# EAGLE design compressor contro0l (EAGLE 9.6.2)
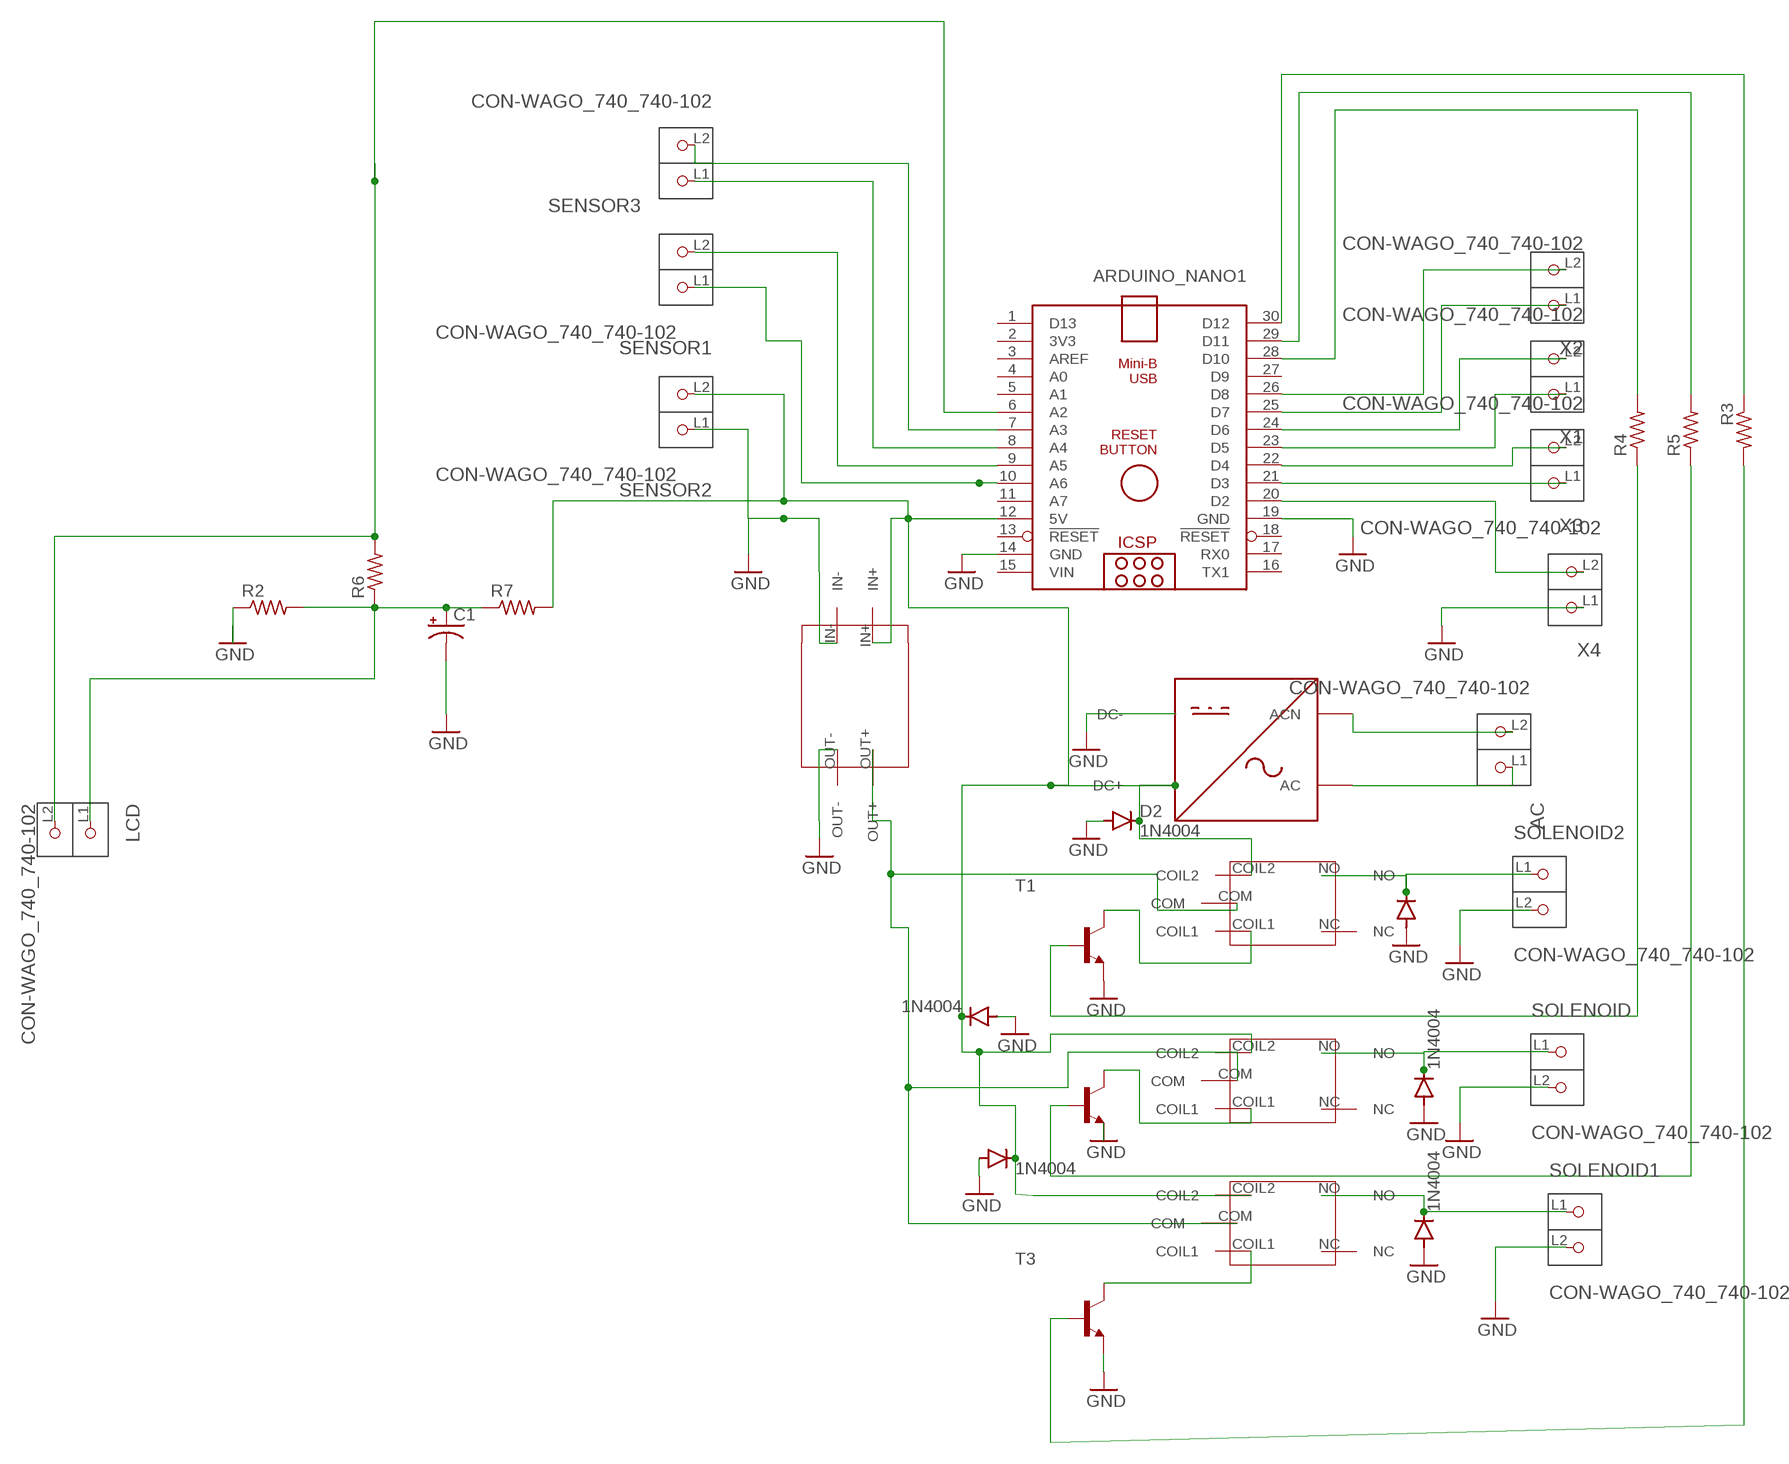
[diagram p0: schematic, sheet 1]

## Parts
AC  CON-WAGO_740_740-102  [CON-WAGO_740_P-740-102]
ACDC  RPD10W1S  [2343]
ARDUINO_NANO1  ARDUINONANOV30-GHIT_ARDUINO_NANO  [ARDUINONANOV30-GHIT_ARDUINO_NANO]
C1  CPOL-USE3.5-8  [E3,5-8]
D2  1N4004  [DO41-10]
D3  1N4004  [DO41-10]
D4  1N4004  [DO41-10]
D5  1N4004  [DO41-10]
D6  1N4004  [DO41-10]
D7  1N4004  [DO41-10]
LCD  CON-WAGO_740_740-102  [CON-WAGO_740_P-740-102]
R2  R-US_0207/10  [0207/10]
R3  R-US_0613/15  [P0613/15]
R4  R-US_0613/15  [P0613/15]
R5  R-US_0613/15  [P0613/15]
R6  R-US_0207/10  [0207/10]
R7  R-US_0207/10  [0207/10]
SENSOR1  CON-WAGO_740_740-102  [CON-WAGO_740_P-740-102]
SENSOR2  CON-WAGO_740_740-102  [CON-WAGO_740_P-740-102]
SENSOR3  CON-WAGO_740_740-102  [CON-WAGO_740_P-740-102]
SOLENOID  CON-WAGO_740_740-102  [CON-WAGO_740_P-740-102]
SOLENOID1  CON-WAGO_740_740-102  [CON-WAGO_740_P-740-102]
SOLENOID2  CON-WAGO_740_740-102  [CON-WAGO_740_P-740-102]
T1  2N2222-NPN-TO92-EBC  [TO92-EBC]
T2  2N2222-NPN-TO92-EBC  [TO92-EBC]
T3  2N2222-NPN-TO92-EBC  [TO92-EBC]
U$2  DC-DCBUCK  [DC-DCBUCK]
U$3  MRELAY2MRELAY2  [MRELAY]
U$4  MRELAY2MRELAY2  [MRELAY]
U$5  MRELAY2MRELAY2  [MRELAY]
X1  CON-WAGO_740_740-102  [CON-WAGO_740_P-740-102]
X2  CON-WAGO_740_740-102  [CON-WAGO_740_P-740-102]
X3  CON-WAGO_740_740-102  [CON-WAGO_740_P-740-102]
X4  CON-WAGO_740_740-102  [CON-WAGO_740_P-740-102]

## Nets
GND: ACDC.DC- ARDUINO_NANO1.14(GND) ARDUINO_NANO1.19(GND) C1.- D2.A D3.A D4.A D5.A D6.A D7.A R2.1 SENSOR2.L1(P1) SOLENOID1.L2(P2) SOLENOID2.L2(P2) SOLENOID.L2(P2) T1.E T2.E T3.E U$2.IN- U$2.OUT- X4.L1(P1)
N$1: ARDUINO_NANO1.9(A5) SENSOR1.L2(P2)
N$2: ARDUINO_NANO1.20(D2) X4.L2(P2)
N$3: ARDUINO_NANO1.21(D3) X3.L1(P1)
N$4: ARDUINO_NANO1.22(D4) X3.L2(P2)
N$5: ARDUINO_NANO1.23(D5) X1.L1(P1)
N$6: ARDUINO_NANO1.24(D6) X1.L2(P2)
N$7: ARDUINO_NANO1.30(D12) R3.1
N$8: ARDUINO_NANO1.25(D7) X2.L1(P1)
N$9: ACDC.DC+ ARDUINO_NANO1.12(5V) D2.C D4.C D5.C R7.2 SENSOR2.L2(P2) U$2.IN+ U$3.COIL2 U$4.COIL2 U$5.COIL2
N$10: ARDUINO_NANO1.10(A6) SENSOR1.L1(P1)
N$11: AC.L2(P2) ACDC.ACN
N$12: ARDUINO_NANO1.8(A4) SENSOR3.L1(P1)
N$13: AC.L1(P1) ACDC.AC
N$14: ARDUINO_NANO1.28(D10) R4.2
N$15: R4.1 T1.B
N$16: ARDUINO_NANO1.29(D11) R5.2
N$17: ARDUINO_NANO1.26(D8) X2.L2(P2)
N$18: U$2.OUT+ U$3.COM U$4.COM U$5.COM
N$19: ARDUINO_NANO1.7(A3) SENSOR3.L2(P2)
N$20: R3.2 T3.B
N$21: R5.1 T2.B
N$22: T2.C U$3.COIL1
N$23: T1.C U$4.COIL1
N$24: T3.C U$5.COIL1
N$26: D7.C SOLENOID1.L1(P1) U$5.NO
N$27: D6.C SOLENOID2.L1(P1) U$4.NO
N$29: D3.C SOLENOID.L1(P1) U$3.NO
N$32: ARDUINO_NANO1.6(A2) LCD.L2(P2) R6.2
N$33: C1.+ LCD.L1(P1) R2.2 R6.1 R7.1
Unconnected: ARDUINO_NANO1.1(D13) ARDUINO_NANO1.2(3V3) ARDUINO_NANO1.3(AREF) ARDUINO_NANO1.4(A0) ARDUINO_NANO1.5(A1) ARDUINO_NANO1.11(A7) ARDUINO_NANO1.13(!RESET) ARDUINO_NANO1.16(TX1) ARDUINO_NANO1.17(RX0) ARDUINO_NANO1.18(!RESET) ARDUINO_NANO1.27(D9) U$3.NC U$4.NC U$5.NC

## Power pins joined to a net without a drawn wire
VIN: ARDUINO_NANO1.15(VIN)

## Library data of the parts
AC LCD SENSOR1-SENSOR3 SOLENOID SOLENOID1 SOLENOID2 X1-X4 = Termnal block:CON-WAGO_740_740-102: Serie 740, Klemmenleiste für Leiterplatten 1 Lötstift/Pol / Series 740, PCB terminal strip 1 solder pin/pole Polzahl / Pole No.: 2 Rastermaß / Pitch: 5 mm Bemessungsspannung / Rated Voltage: 320 V Nennstrom / Nominal Current: 16 A Leiterquerschnitt / Conductor Size: 0.08 - 2.5 mm² Anschlusstechnik / Connection Technology: CAGE CLAMP® Lötstiftlänge: / Solder Pin Length: 5.1 mm Leitereinführung (zur Platine) / Conductor entry angle (to PCB): 0 ° Farbe / Color: grau / gray Stand: 01.01.2012. Die jeweils aktuellen Daten zu diesem Artikel finden Sie in unserem Produktkatalog, den Sie unter www.wago.com einsehen können. As of: 01/01/2012. Please find the newest data for this article in our product catalogue, which can be viewed under www.wago.com.
ACDC = My_libray:RPD10W1S
ARDUINO_NANO1 = Arduino Nano GHII:ARDUINONANOV30-GHIT_ARDUINO_NANO: Arduino Nano V3.0 Overview: The Arduino Nano is a small, complete, and breadboard-friendly board based on the ATmega328 (Arduino Nano 3.x) or ATmega168 (Arduino Nano 2.x). It has more or less the same functionality of the Arduino Duemilanove, but in a different package. It lacks only a DC power jack, and works with a Mini-B USB cable instead of a standard one. The Nano was designed and is being produced by Gravitech. Specifications: Microcontroller Atmel ATmega168 or ATmega328 Operating Voltage (logic level) 5 V Input Voltage (recommended) 7-12 V Input Voltage (limits) 6-20 V Digital I/O Pins 14 (of which 6 provide PWM output) Analog Input Pins 8 DC Current per I/O Pin 40 mA Flash Memory 16 KB (ATmega168) or 32 KB (ATmega328) of which 2 KB used by bootloader SRAM 1 KB (ATmega168) or 2 KB (ATmega328) EEPROM 512 bytes (ATmega168) or 1 KB (ATmega328) Clock Speed 16 MHz Dimensions 0.73" x 1.70" Length 45 mm Width 18 mm Weigth 5 g Power: The Arduino Nano can be powered via the Mini-B USB connection, 6-20V unregulated external power supply (pin 30), or 5V regulated external power supply (pin 27). The power source is automatically selected to the highest voltage source. Memory: The ATmega168 has 16 KB of flash memory for storing code (of which 2 KB is used for the bootloader); the ATmega328 has 32 KB, (also with 2 KB used for the bootloader). The ATmega168 has 1 KB of SRAM and 512 bytes of EEPROM (which can be read and written with the EEPROM library); the ATmega328 has 2 KB of SRAM and 1 KB of EEPROM. Input and Output: Each of the 14 digital pins on the Nano can be used as an input or output, using pinMode(), digitalWrite(), and digitalRead() functions. They operate at 5 volts. Each pin can provide or receive a maximum of 40 mA and has an internal pull-up resistor (disconnected by default) of 20-50 kOhms. In addition, some pins have specialized functions. Visit Arduino - ArduinoBoardNano <https://www.arduino.cc/en/Main/ArduinoBoardNano>
C1 = adafruit:CPOL-US: POLARIZED CAPACITOR, American symbol
D2-D7 = diode:1N4004: DIODE general purpose rectifier, 1 A
R2 R6 R7 = rcl:R-US_: RESISTOR, American symbol; SPICEPREFIX: R
R3-R5 = adafruit:R-US_: RESISTOR, American symbol
T1-T3 = transistor-neu-to92:*-NPN-: NPN Transistror
U$2 = dc-dcbuck:DC-DCBUCK: steps down voltage
U$3-U$5 = mrelay:MRELAY2: 5pin relay

## Net classes
0 default: width 1.499 mm, drill 0.762 mm, clearance 0.635 mm

## Board
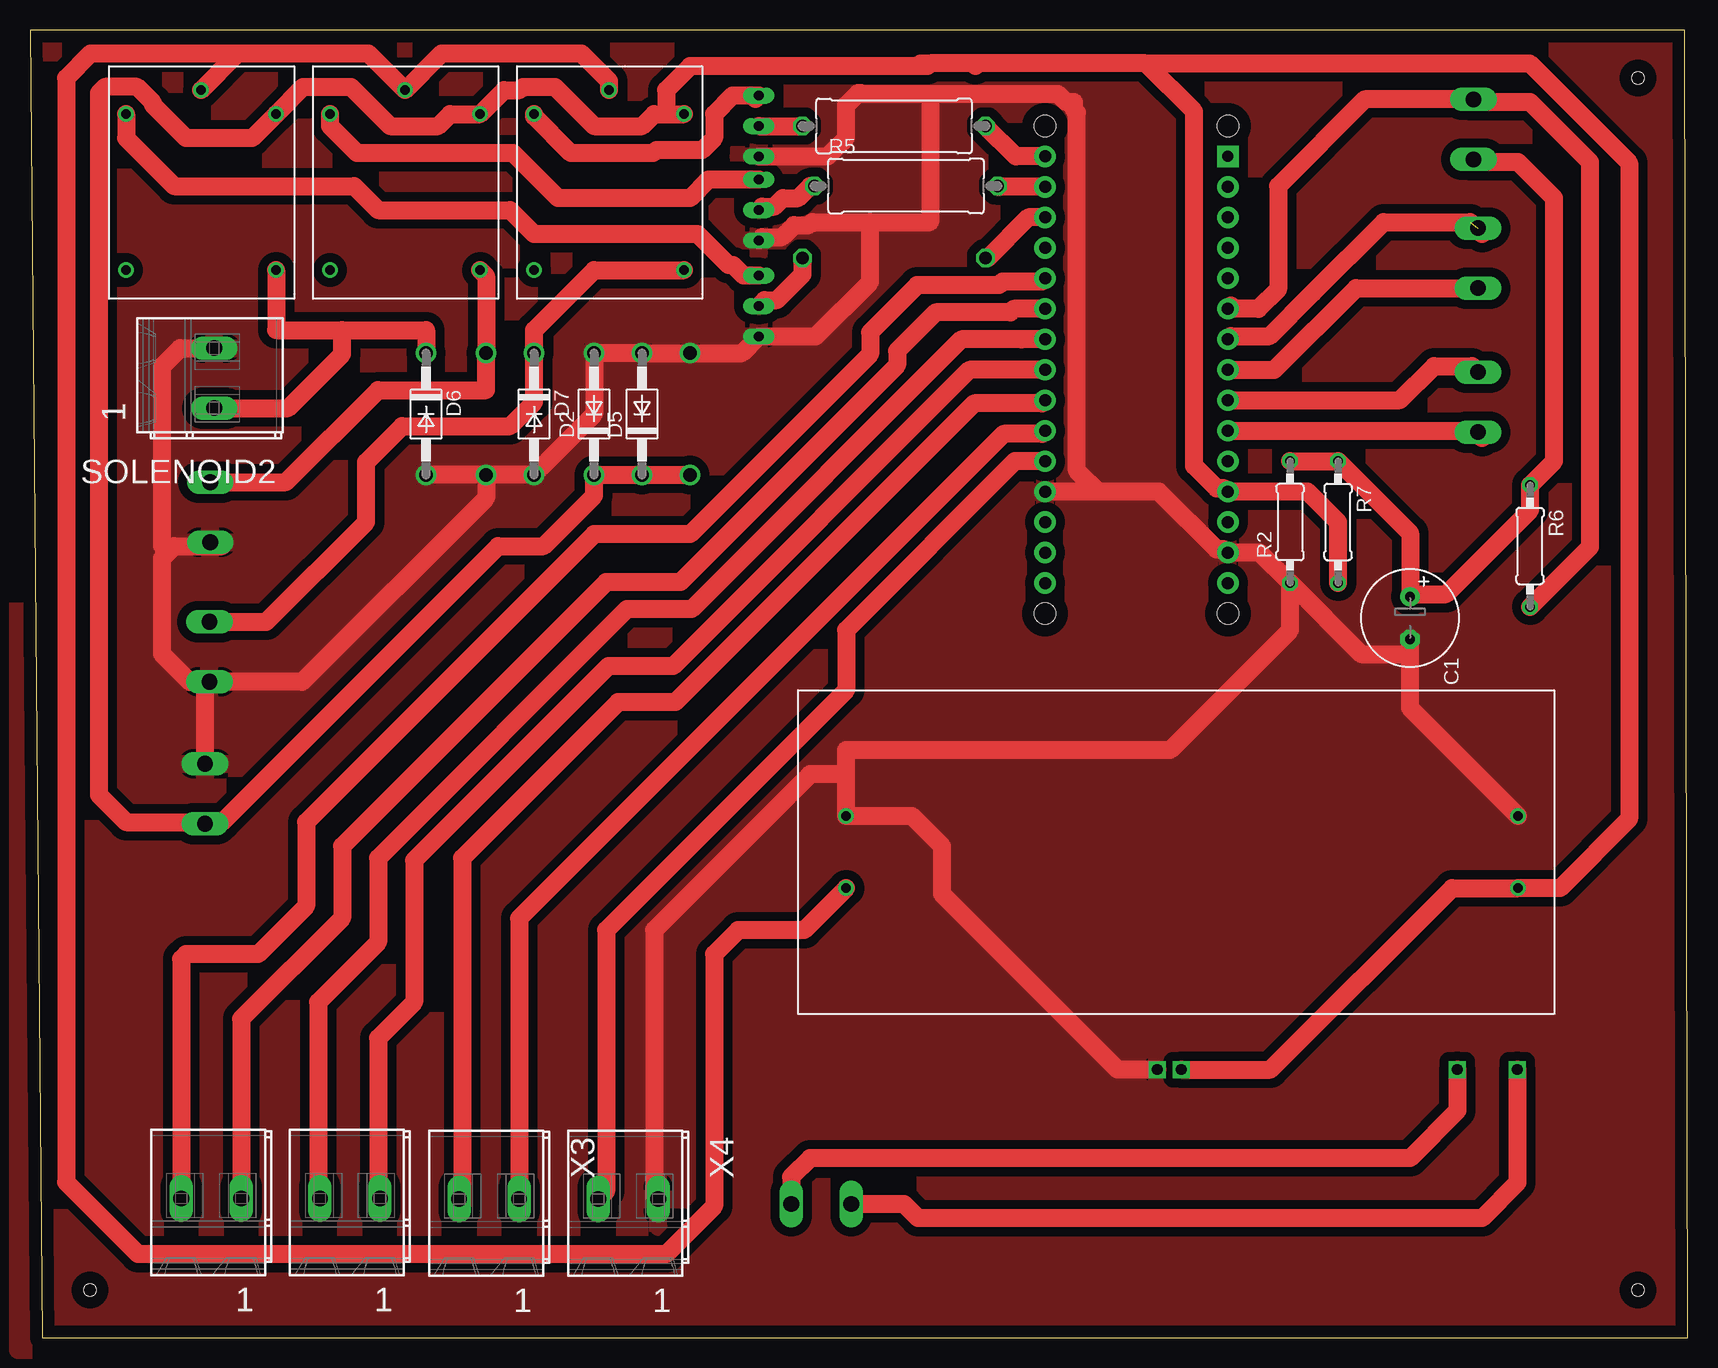
[diagram p1: board, top side]
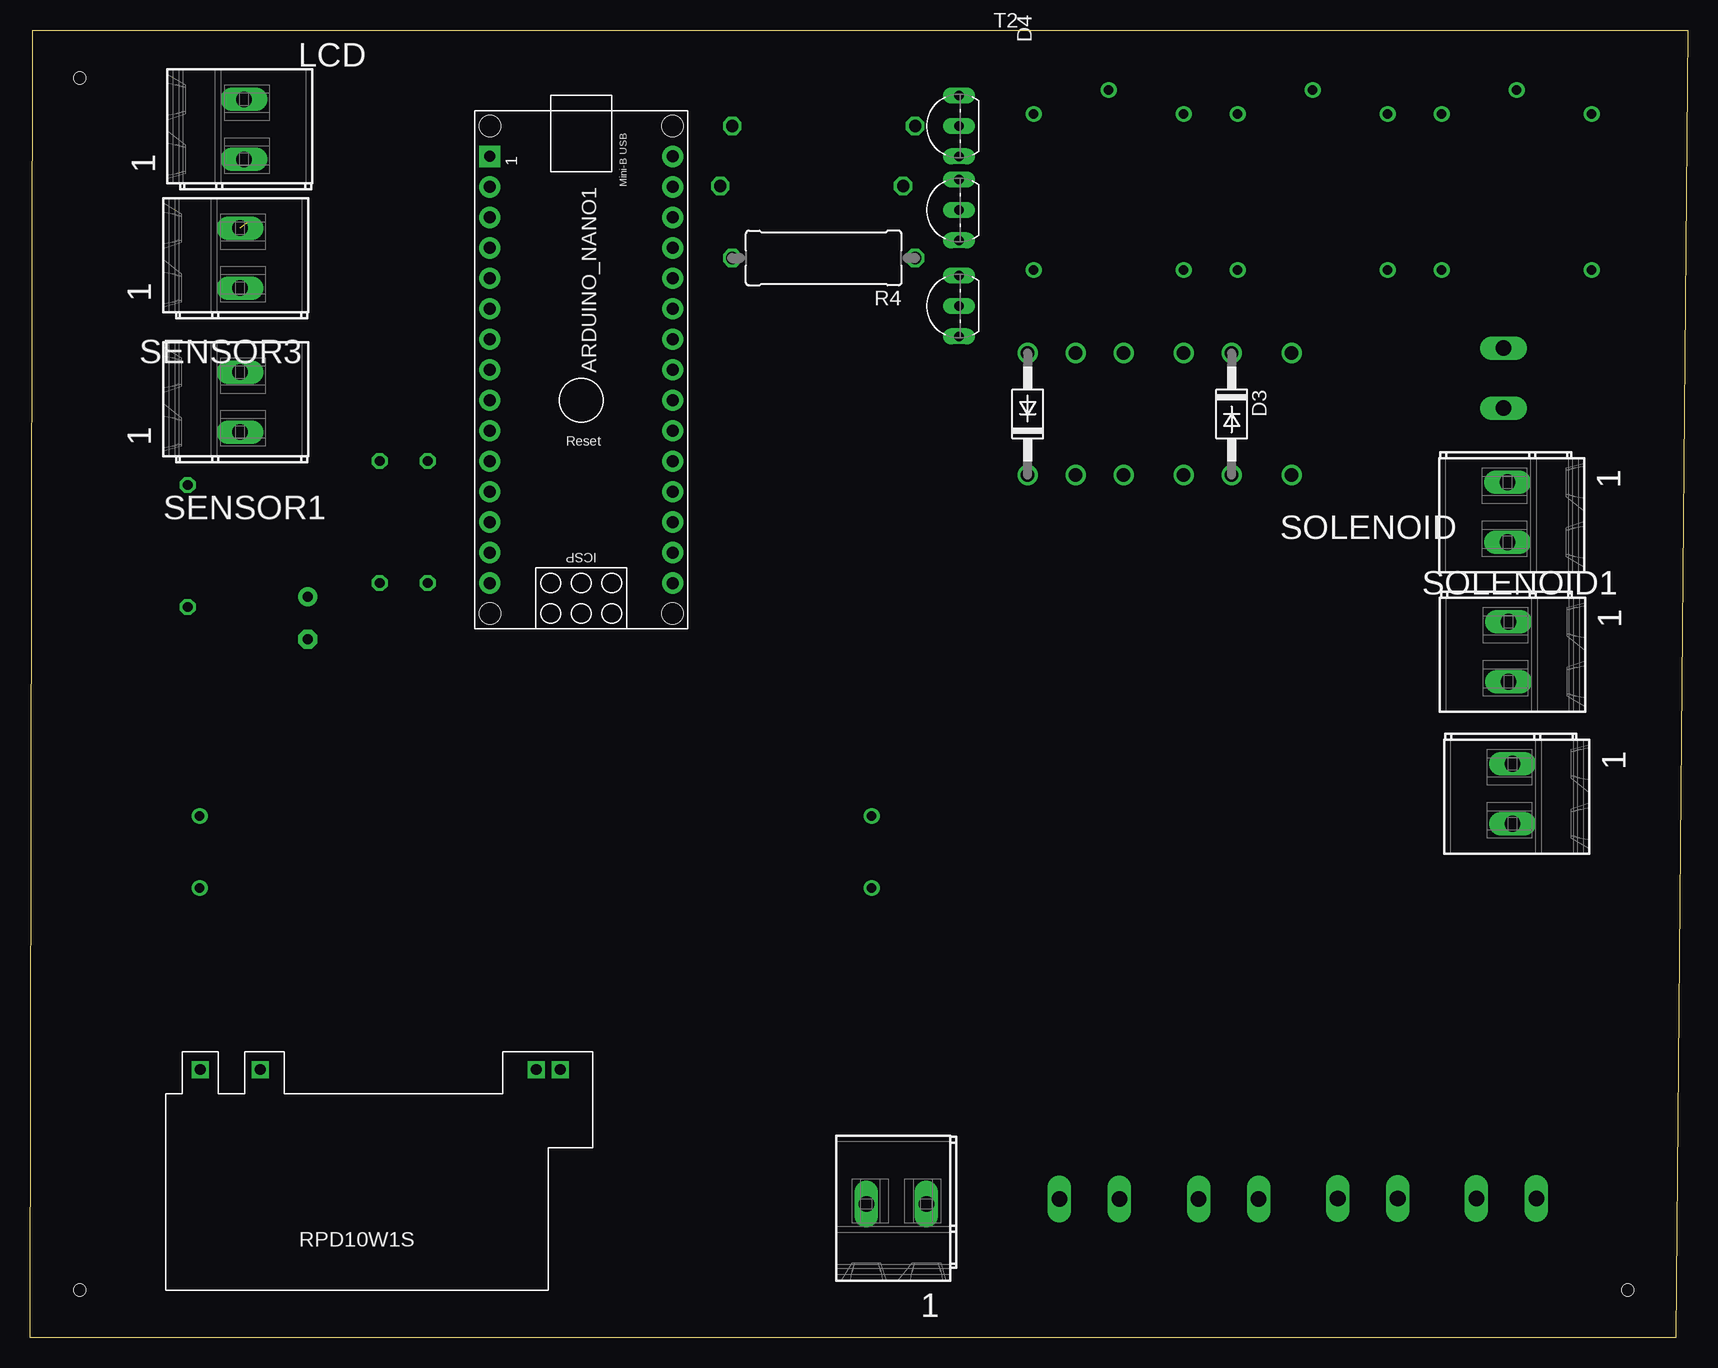
[diagram p2: board, bottom side, seen from below]

Size 138.14 x 108.98 mm. Coordinates in mm from the lower left corner, seen from the top.
Outline: 0,108.98 1,0 138.14,0 137.91,108.97 0,108.98
Copper layers (1*16): Top 0.035mm / dielectric 1.5mm / Bottom 0.035mm
Design rules "default *": minimum track width 6mil, minimum drill 0.35mm, track to track 30mil, track to pad 6mil, pad to pad 6mil, via to via 6mil, smd to smd 6mil, copper to edge 40mil, drill to drill 6mil, minimum pad ring 10mil, minimum via ring 8mil, stop-mask expansion 4mil, vias tented up to drill 0mil, thermal gap 10mil
Holes 1 mm at 5,3.98 134,3.98 134,104.98

### Footprints (pad centres in the part's own frame; a part is rotated, then mirrored left to right if it is on the bottom)
CON-WAGO_740_P-740-102 = drill 1.3 long: L1 -0.35,2.5; L2 -0.35,-2.5
2343 = drill 0.9 square: AC 2.7,-13.5; ACN 7.7,-13.5; DC+ -20.3,-13.5; DC- -22.3,-13.5
ARDUINONANOV30-GHIT_ARDUINO_NANO = drill 0.9 pad 1.778 square: 1 -20.32,-7.62 | drill 1 pad 1.778: 2 -17.78,-7.62; 3 -15.24,-7.62; 4 -12.7,-7.62; 5 -10.16,-7.62; 6 -7.62,-7.62; 7 -5.08,-7.62; 8 -2.54,-7.62; 9 0,-7.62; 10 2.54,-7.62; 11 5.08,-7.62; 12 7.62,-7.62; 13 10.16,-7.62; 14 12.7,-7.62; 15 15.24,-7.62; 16 15.24,7.62; 17 12.7,7.62; 18 10.16,7.62; 19 7.62,7.62; 20 5.08,7.62; 21 2.54,7.62; 22 0,7.62; 23 -2.54,7.62; 24 -5.08,7.62; 25 -7.62,7.62; 26 -10.16,7.62; 27 -12.7,7.62; 28 -15.24,7.62; 29 -17.78,7.62; 30 -20.32,7.62 | hole 1.778: -22.86,-7.62; -22.86,7.62; 17.78,7.62; 17.78,-7.62
E3,5-8 = drill 0.813 pad 1.6: + -1.778,0 | drill 0.813 pad 1.6 octagon: - 1.778,0
DO41-10 = drill 1.118: A 5.08,0; C -5.08,0
0207/10 = drill 0.813 octagon: 1 -5.08,0; 2 5.08,0
P0613/15 = drill 1.016 octagon: 1 -7.62,0; 2 7.62,0
TO92-EBC = drill 0.813 long: B 0,-1.27; C 2.54,-1.27; E -2.54,-1.27
DC-DCBUCK = drill 0.8: IN+ 10.5,3; IN- 16.5,3; OUT+ 10.5,59; OUT- 16.5,59
MRELAY = drill 0.8: COIL1 0,13; COIL2 12.5,13; COM 6.25,15; NC 0,0; NO 12.5,0

### Placement (x,y rotation side)
AC  65.94,10.79 270 bottom
ACDC  116.24,8.85 180 bottom
ARDUINO_NANO1  92.2,78.13 270 bottom
C1  115,59.98 270 top
D2  47,76.98 90 top
D3  38,76.98 270 bottom
D4  55,76.98 90 bottom
D5  51,76.98 90 top
D6  33,76.98 270 top
D7  42,76.98 270 top
LCD  120.65,100.7 180 bottom
R2  105,67.98 90 top
R3  72,100.98 180 top
R4  72,89.98 180 bottom
R5  73,95.98 0 top
R6  125,65.98 270 top
R7  109,67.98 270 top
SENSOR1  121,77.98 180 bottom
SENSOR2  14.24,45.33 0 bottom
SENSOR3  121,89.98 180 bottom
SOLENOID  14.67,68.79 0 bottom
SOLENOID1  14.59,57.17 0 bottom
SOLENOID2  15,79.98 180 top
T1  62,85.98 90 bottom
T2  62,93.98 90 bottom
T3  62,100.98 90 bottom
U$2  127,26.98 90 top
U$3  25,88.98 0 top
U$4  8,88.98 0 top
U$5  42,88.98 0 top
X1  26.66,11.27 270 top
X2  15.1,11.27 270 top
X3  38.26,11.2 270 top
X4  49.86,11.2 270 top

### Tracks (layer width: path | path; a pad name or v marks a point on that pad's centre or on a via)
GND
  Top 1.499: R2.1 105,58.98 95,48.98 68,48.98 68,46.98 | R2.1 102.47,65.43 ARDUINO_NANO1.14 99.56,65.69 98.88,65.69 94.07,70.51 89,70.51 | U$2.IN- 115,52.48 115,56.98 | 115,56.98 C1.- | 89,70.51 ARDUINO_NANO1.19 | 89,70.51 87.24,72.27 87.24,102.09 87,102.33 87,102.98 86.34,102.98 85.68,103.64 75,103.64 | X4.L1 52,11.91 52,33.98 65,46.98 68,46.98 | 75,103.64 69.34,103.64 69.26,103.72 69,103.72 68,102.72 68,99.98 66.46,98.44 T3.E | 75,103.64 75,92.98 70,92.98 | D3.A D7.A 42,71.98 47,76.98 D2.A D5.A D4.A 59.35,82.06 T1.E 65.46,83.44 70,87.98 70,92.98 | D3.A D6.A | R2.1 110.92,56.98 115,56.98 | 68,46.98 U$2.OUT- 73.5,43.48 76,40.98 76,36.98 90.63,22.35 ACDC.DC- | D3.A 38,69.98 22.69,54.67 SOLENOID1.L2 | SENSOR2.L1 14.59,54.31 SOLENOID1.L2 | SOLENOID1.L2 13.31,54.67 11,56.98 11,64.98 11.5,65.48 | 11.5,65.48 12,65.98 16,65.98 15.69,66.29 SOLENOID.L2 | 11.5,65.48 11,65.98 11,80.98 12.5,82.48 SOLENOID2.L2 | T2.E 61.01,91.72 62.68,91.72 63.68,92.72 64.94,92.72 65.2,92.98 70,92.98
  pour Top (isolate 0.64, rank 6): -1,-1.02 -1,109.98 139,109.98 139,-1.02
N$1
  Top 1.499: ARDUINO_NANO1.9 114.15,78.13 117,80.98 120.15,80.98 SENSOR1.L2
N$2
  Top 1.499: ARDUINO_NANO1.20 82.07,73.05 68,58.98 68,53.98 48,33.98 48,12.19 X4.L2
N$3
  Top 1.499: ARDUINO_NANO1.21 84.32,75.32 81.14,75.32 40.76,34.94 X3.L1
N$4
  Top 1.499: ARDUINO_NANO1.22 84.32,77.86 78.67,77.86 53.79,52.98 49,52.98 36,39.98 36,10.98 35.76,11.22 X3.L2
N$5
  Top 1.499: ARDUINO_NANO1.23 78.28,80.67 53.59,55.98 48.2,55.98 32,39.78 32,27.98 29,24.98 29,11.78 X1.L1
N$6
  Top 1.499: ARDUINO_NANO1.24 82.64,83.21 82.63,83.2 77.61,83.2 55.13,60.72 49.74,60.72 29,39.98 29,32.98 24,27.98 24,11.78 X1.L2
N$7
  Top 1.499: ARDUINO_NANO1.30 82.15,98.45 R3.1
N$8
  Top 1.499: ARDUINO_NANO1.25 81.98,85.75 81.69,85.46 75.48,85.46 72.26,82.24 72.26,81.04 54.2,62.98 48,62.98 26,40.98 26,34.98 17.6,26.58 X2.L1
N$9
  Top 1.499: R7.2 109,67.98 106.47,70.51 ARDUINO_NANO1.12 99.56,70.77 98.88,70.77 97,72.66 97,102.21 93,106.21 | 93,106.21 79,106.21 | 79,106.21 75,106.21 | 74.23,106.21 75,106.21 | 79,106.21 78.77,105.98 | 93,106.21 124.97,106.21 133.26,97.92 133.26,43.24 127.5,37.48 U$2.IN+ 118.5,37.48 103.37,22.35 ACDC.DC+ | 47,70.98 D2.C | D2.C D5.C D4.C | D2.C 47,70.18 42.8,65.98 39,65.98 16,42.98 14.73,42.98 | 75,106.21 74.77,105.98 55,105.98 53,103.98 53,101.98 | 53,101.98 U$5.COIL2 | 53,101.98 52,101.98 51,100.98 47,100.98 43.74,104.24 41.06,104.24 40.8,103.98 39.5,103.98 U$3.COIL2 35,101.98 34,100.98 30,100.98 26.74,104.24 22.76,104.24 U$4.COIL2 18.5,99.98 13,99.98 10.26,102.72 10.26,102.92 8.94,104.24 6.26,104.24 5.74,103.72 5.74,45.24 8,42.98 14.73,42.98 | SENSOR2.L2 14.73,42.98
N$10
  Top 1.499: SENSOR1.L1 121,75.13 121,74.98 120.39,75.59 ARDUINO_NANO1.10
N$11
  Top 1.499: ACDC.ACN 123.94,12.93 121,9.98 74,9.98 72.84,11.14 AC.L2
N$12
  Top 1.499: ARDUINO_NANO1.8 103.69,80.67 110.5,87.48 SENSOR3.L1
N$13
  Top 1.499: ACDC.AC 118.94,18.93 115,14.98 65,14.98 63.44,13.42 AC.L1
N$14
  Top 1.499: ARDUINO_NANO1.28 83.2,93.37 79.82,89.98 R4.2
N$15
  Top 1.499: T1.B 61.23,86.48 62.24,86.48 64.38,88.62 R4.1
N$16
  Top 1.499: ARDUINO_NANO1.29 80.69,95.91 R5.2
N$17
  Top 1.499: X2.L2 12.6,31.58 13,31.98 19,31.98 23,35.98 23,42.98 47,66.98 55,66.98 70,81.98 70,83.78 73.94,87.72 80.75,87.72 81.05,88.02 84.32,88.02 ARDUINO_NANO1.26
N$18
  Top 1.499: U$5.COM 48.25,104.73 45.96,107.02 34.29,107.02 U$3.COM 28.21,107.02 17.29,107.02 | U$4.COM 17.29,107.02 | 17.29,107.02 5.04,107.02 3,104.98 3,12.98 9,6.98 53,6.98 57,10.98 57,31.98 59,33.98 64.5,33.98 U$2.OUT+
N$19  (1 unrouted)
  Top 1.499: 121,91.98 121,92.13 SENSOR3.L2 | ARDUINO_NANO1.7 100.09,83.47 103.3,83.47 106.9,87.08 112.8,92.98 120,92.98
N$20
  Top 1.499: T3.B R3.2
N$21
  Top 1.499: T2.B 61.01,94.26 62.02,94.26 62.74,94.98 64,94.98 65,95.98 R5.1
N$22
  Top 1.499: U$3.COIL1 25,100.98 27.26,98.72 40.26,98.72 44,94.98 55,94.98 56.54,96.52 T2.C
N$23
  Top 1.499: U$4.COIL1 8,99.98 12,95.98 27,95.98 29,93.98 40,93.98 42,91.98 55.64,91.98 58.22,89.4 58.59,89.4 59.46,88.52 T1.C
N$24
  Top 1.499: 60.45,103.24 T3.C 58.54,103.52 57,101.98 57,99.98 56,98.98 52.2,98.98 51.94,98.72 45.06,98.72 42,101.78 U$5.COIL1
N$26
  Top 1.499: U$5.NO 47,88.98 42,83.98 D7.C 42,77.98 40,75.98 31,75.98 28,72.98 28,67.98 19.69,59.67 SOLENOID1.L1
N$27
  Top 1.499: D6.C 33,83.98 26,83.98 | U$4.NO 20.5,83.98 26,83.98 | SOLENOID2.L1 21.5,77.48 26,81.98 26,83.98
N$29
  Top 1.499: U$3.NO 38,88.48 D3.C 38,78.98 29,78.98 21.31,71.29 SOLENOID.L1
N$32
  Top 1.499: R6.2 130,65.9 130,97.98 125,102.98 120,102.98 120.22,103.2 LCD.L2 111.22,103.2 104,95.98 104,87.37 102.37,85.75 ARDUINO_NANO1.6 | ARDUINO_NANO1.6 100.09,86.01 | ARDUINO_NANO1.6 99.82,85.8
N$33
  Top 1.499: R2.2 R7.1 115,67.06 C1.+ 115.22,61.98 118,61.98 125,68.98 R6.1 127,73.06 127,94.98 124,97.98 120,97.98 120.22,98.2 LCD.L1